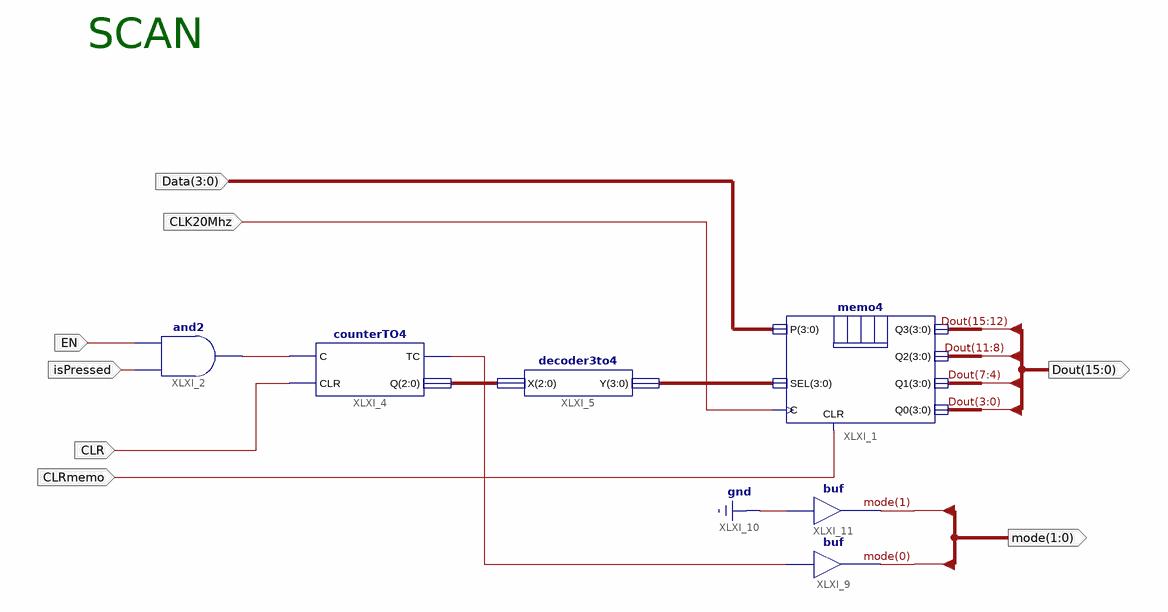
[diagram p0: schematic sheet 1]
// Xilinx ISE schematic SCAN.sch (spartan6) as structural Verilog: 6 symbols, 8 ports
module SCAN (
  input  EN,
  input  isPressed,
  input  CLK20Mhz,
  input  [3:0] Data,
  input  CLR,
  input  CLRmemo,
  output [15:0] Dout,
  output [1:0] mode
);

  wire XLXN_5, XLXN_9;
  wire [2:0] XLXN_6;
  wire [3:0] XLXN_7;

  memo4 XLXI_1 (
    .Q3(Dout[15:12]), .Q2(Dout[11:8]), .Q1(Dout[7:4]), .Q0(Dout[3:0]), .P(Data), .C(CLK20Mhz), .CLR(CLRmemo),
    .SEL(XLXN_7));
  and XLXI_2 (XLXN_5, isPressed, EN);
  counterTO4 XLXI_4 (.C(XLXN_5), .CLR(CLR), .TC(XLXN_9), .Q(XLXN_6));
  decoder3to4 XLXI_5 (.X(XLXN_6), .Y(XLXN_7));
  buf XLXI_9 (mode[0], XLXN_9);
  buf XLXI_11 (mode[1], 1'b0);

  // Notes on the sheet:
  //   SCAN
endmodule
